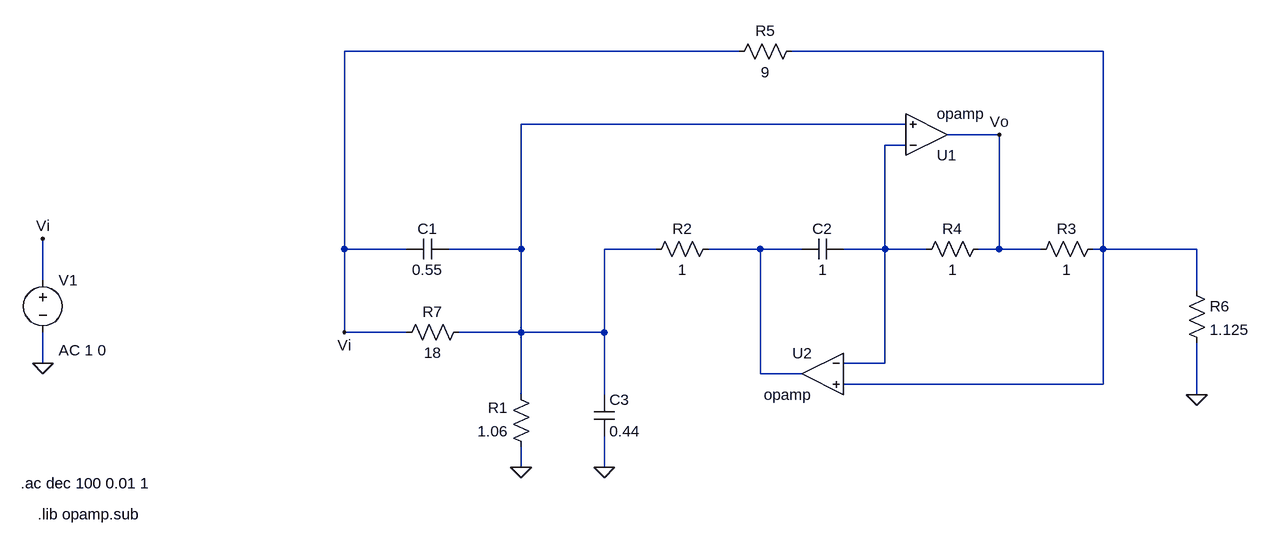
[diagram p0: schematic circ_Schaumann.asc]
circ_Schaumann.asc, the LTspice schematic file:
Version 4
SHEET 1 1496 680
WIRE 704 -240 96 -240
WIRE 1264 -240 784 -240
WIRE 960 -128 368 -128
WIRE 1104 -112 1024 -112
WIRE 960 -96 928 -96
WIRE 96 64 96 -240
WIRE 192 64 96 64
WIRE 368 64 368 -128
WIRE 368 64 256 64
WIRE 576 64 496 64
WIRE 736 64 656 64
WIRE 800 64 736 64
WIRE 928 64 928 -96
WIRE 928 64 864 64
WIRE 992 64 928 64
WIRE 1104 64 1104 -112
WIRE 1104 64 1072 64
WIRE 1168 64 1104 64
WIRE 1264 64 1264 -240
WIRE 1264 64 1248 64
WIRE 1408 64 1264 64
WIRE -368 112 -368 48
WIRE 1408 128 1408 64
WIRE 96 192 96 64
WIRE 192 192 96 192
WIRE 368 192 368 64
WIRE 368 192 272 192
WIRE 496 192 496 64
WIRE 496 192 368 192
WIRE -368 240 -368 192
WIRE 928 240 928 64
WIRE 928 240 864 240
WIRE 736 256 736 64
WIRE 800 256 736 256
WIRE 1264 272 1264 64
WIRE 1264 272 864 272
WIRE 368 288 368 192
WIRE 496 288 496 192
WIRE 1408 288 1408 208
WIRE 368 400 368 368
WIRE 496 400 496 352
FLAG 368 400 0
FLAG 1408 288 0
FLAG 496 400 0
FLAG 96 192 Vi
FLAG -368 48 Vi
FLAG 1104 -112 Vo
FLAG -368 240 0
SYMBOL res 384 384 R180
WINDOW 0 36 76 Left 2
WINDOW 3 36 40 Left 2
SYMATTR InstName R1
SYMATTR Value 1.06
SYMBOL res 560 80 R270
WINDOW 0 32 56 VTop 2
WINDOW 3 0 56 VBottom 2
SYMATTR InstName R2
SYMATTR Value 1
SYMBOL res 1152 80 R270
WINDOW 0 32 56 VTop 2
WINDOW 3 0 56 VBottom 2
SYMATTR InstName R3
SYMATTR Value 1
SYMBOL res 976 80 R270
WINDOW 0 32 56 VTop 2
WINDOW 3 0 56 VBottom 2
SYMATTR InstName R4
SYMATTR Value 1
SYMBOL res 688 -224 R270
WINDOW 0 32 56 VTop 2
WINDOW 3 0 56 VBottom 2
SYMATTR InstName R5
SYMATTR Value 9
SYMBOL cap 256 48 R90
WINDOW 0 0 32 VBottom 2
WINDOW 3 32 32 VTop 2
SYMATTR InstName C1
SYMATTR Value 0.55
SYMBOL cap 864 48 R90
WINDOW 0 0 32 VBottom 2
WINDOW 3 32 32 VTop 2
SYMATTR InstName C2
SYMATTR Value 1
SYMBOL OpAmps\\opamp 992 -48 M180
SYMATTR InstName U1
SYMBOL OpAmps\\opamp 832 192 M0
SYMATTR InstName U2
SYMBOL res 1392 112 R0
SYMATTR InstName R6
SYMATTR Value 1.125
SYMBOL res 288 176 R90
WINDOW 0 0 56 VBottom 2
WINDOW 3 32 56 VTop 2
SYMATTR InstName R7
SYMATTR Value 18
SYMBOL cap 480 288 R0
SYMATTR InstName C3
SYMATTR Value 0.44
SYMBOL voltage -368 96 R0
WINDOW 123 24 124 Left 2
WINDOW 39 0 0 Left 0
SYMATTR InstName V1
SYMATTR Value ""
SYMATTR Value2 AC 1 0
TEXT -402 424 Left 2 !.ac dec 100 0.01 1
TEXT -376 472 Left 2 !.lib opamp.sub

The netlist it stands for:
* circ_Schaumann.asc
R1 0 N002 1.06
R2 N002 N004 1
R3 Vo N001 1
R4 N003 Vo 1
R5 Vi N001 9
C1 N002 Vi 0.55
C2 N003 N004 1
XU1 N003 N002 Vo opamp Aol=100K GBW=10Meg  ; pins invin noninvin out
XU2 N003 N001 N004 opamp Aol=100K GBW=10Meg  ; pins invin noninvin out
R6 N001 0 1.125
R7 N002 Vi 18
C3 N002 0 0.44
V1 Vi 0 AC 1 0
.ac dec 100 0.01 1
.lib opamp.sub
.backanno
.end